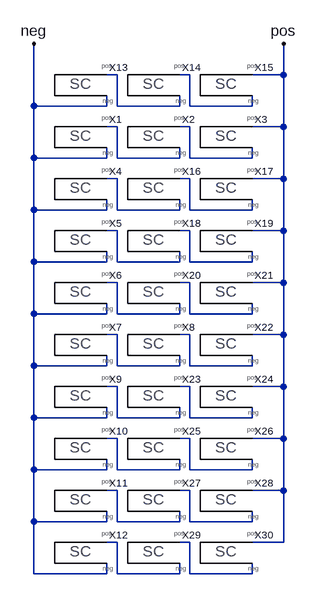
[diagram p0: schematic solarpanelsymbol.asc]
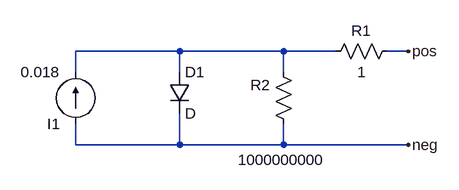
[diagram p1: sub-circuit solarcellsymbol.asc]
solarpanelsymbol.asc, the LTspice schematic file:
Version 4
SHEET 1 880 800
WIRE 176 0 160 0
WIRE 288 0 272 0
WIRE 432 0 432 -48
WIRE 432 0 384 0
WIRE 48 48 48 -48
WIRE 160 48 160 32
WIRE 160 48 48 48
WIRE 176 48 176 0
WIRE 272 48 272 32
WIRE 272 48 176 48
WIRE 288 48 288 0
WIRE 384 48 384 32
WIRE 384 48 288 48
WIRE 176 80 160 80
WIRE 288 80 272 80
WIRE 432 80 432 0
WIRE 432 80 384 80
WIRE 48 128 48 48
WIRE 160 128 160 112
WIRE 160 128 48 128
WIRE 176 128 176 80
WIRE 272 128 272 112
WIRE 272 128 176 128
WIRE 288 128 288 80
WIRE 384 128 384 112
WIRE 384 128 288 128
WIRE 176 160 160 160
WIRE 288 160 272 160
WIRE 432 160 432 80
WIRE 432 160 384 160
WIRE 48 208 48 128
WIRE 160 208 160 192
WIRE 160 208 48 208
WIRE 176 208 176 160
WIRE 272 208 272 192
WIRE 272 208 176 208
WIRE 288 208 288 160
WIRE 384 208 384 192
WIRE 384 208 288 208
WIRE 176 240 160 240
WIRE 288 240 272 240
WIRE 432 240 432 160
WIRE 432 240 384 240
WIRE 48 288 48 208
WIRE 160 288 160 272
WIRE 160 288 48 288
WIRE 176 288 176 240
WIRE 272 288 272 272
WIRE 272 288 176 288
WIRE 288 288 288 240
WIRE 384 288 384 272
WIRE 384 288 288 288
WIRE 176 320 160 320
WIRE 288 320 272 320
WIRE 432 320 432 240
WIRE 432 320 384 320
WIRE 48 368 48 288
WIRE 160 368 160 352
WIRE 160 368 48 368
WIRE 176 368 176 320
WIRE 272 368 272 352
WIRE 272 368 176 368
WIRE 288 368 288 320
WIRE 384 368 384 352
WIRE 384 368 288 368
WIRE 176 400 160 400
WIRE 288 400 272 400
WIRE 432 400 432 320
WIRE 432 400 384 400
WIRE 48 448 48 368
WIRE 160 448 160 432
WIRE 160 448 48 448
WIRE 176 448 176 400
WIRE 272 448 272 432
WIRE 272 448 176 448
WIRE 288 448 288 400
WIRE 384 448 384 432
WIRE 384 448 288 448
WIRE 176 480 160 480
WIRE 288 480 272 480
WIRE 432 480 432 400
WIRE 432 480 384 480
WIRE 48 528 48 448
WIRE 160 528 160 512
WIRE 160 528 48 528
WIRE 176 528 176 480
WIRE 272 528 272 512
WIRE 272 528 176 528
WIRE 288 528 288 480
WIRE 384 528 384 512
WIRE 384 528 288 528
WIRE 176 560 160 560
WIRE 288 560 272 560
WIRE 432 560 432 480
WIRE 432 560 384 560
WIRE 48 608 48 528
WIRE 160 608 160 592
WIRE 160 608 48 608
WIRE 176 608 176 560
WIRE 272 608 272 592
WIRE 272 608 176 608
WIRE 288 608 288 560
WIRE 384 608 384 592
WIRE 384 608 288 608
WIRE 176 640 160 640
WIRE 288 640 272 640
WIRE 432 640 432 560
WIRE 432 640 384 640
WIRE 48 688 48 608
WIRE 160 688 160 672
WIRE 160 688 48 688
WIRE 176 688 176 640
WIRE 272 688 272 672
WIRE 272 688 176 688
WIRE 288 688 288 640
WIRE 384 688 384 672
WIRE 384 688 288 688
WIRE 176 720 160 720
WIRE 288 720 272 720
WIRE 432 720 432 640
WIRE 432 720 384 720
WIRE 48 768 48 688
WIRE 160 768 160 752
WIRE 160 768 48 768
WIRE 176 768 176 720
WIRE 272 768 272 752
WIRE 272 768 176 768
WIRE 288 768 288 720
WIRE 384 768 384 752
WIRE 384 768 288 768
FLAG 432 -48 pos
FLAG 48 -48 neg
SYMBOL solarcellsymbol 112 96 R0
SYMATTR InstName X1
SYMBOL solarcellsymbol 224 96 R0
SYMATTR InstName X2
SYMBOL solarcellsymbol 336 96 R0
SYMATTR InstName X3
SYMBOL solarcellsymbol 112 176 R0
SYMATTR InstName X4
SYMBOL solarcellsymbol 112 256 R0
SYMATTR InstName X5
SYMBOL solarcellsymbol 112 336 R0
SYMATTR InstName X6
SYMBOL solarcellsymbol 112 416 R0
SYMATTR InstName X7
SYMBOL solarcellsymbol 224 416 R0
SYMATTR InstName X8
SYMBOL solarcellsymbol 112 496 R0
SYMATTR InstName X9
SYMBOL solarcellsymbol 112 576 R0
SYMATTR InstName X10
SYMBOL solarcellsymbol 112 656 R0
SYMATTR InstName X11
SYMBOL solarcellsymbol 112 736 R0
SYMATTR InstName X12
SYMBOL solarcellsymbol 112 16 R0
SYMATTR InstName X13
SYMBOL solarcellsymbol 224 16 R0
SYMATTR InstName X14
SYMBOL solarcellsymbol 336 16 R0
SYMATTR InstName X15
SYMBOL solarcellsymbol 224 176 R0
SYMATTR InstName X16
SYMBOL solarcellsymbol 336 176 R0
SYMATTR InstName X17
SYMBOL solarcellsymbol 224 256 R0
SYMATTR InstName X18
SYMBOL solarcellsymbol 336 256 R0
SYMATTR InstName X19
SYMBOL solarcellsymbol 224 336 R0
SYMATTR InstName X20
SYMBOL solarcellsymbol 336 336 R0
SYMATTR InstName X21
SYMBOL solarcellsymbol 336 416 R0
SYMATTR InstName X22
SYMBOL solarcellsymbol 224 496 R0
SYMATTR InstName X23
SYMBOL solarcellsymbol 336 496 R0
SYMATTR InstName X24
SYMBOL solarcellsymbol 224 576 R0
SYMATTR InstName X25
SYMBOL solarcellsymbol 336 576 R0
SYMATTR InstName X26
SYMBOL solarcellsymbol 224 656 R0
SYMATTR InstName X27
SYMBOL solarcellsymbol 336 656 R0
SYMATTR InstName X28
SYMBOL solarcellsymbol 224 736 R0
SYMATTR InstName X29
SYMBOL solarcellsymbol 336 736 R0
SYMATTR InstName X30

solarcellsymbol.asc, the sub-circuit schematic file:
Version 4
SHEET 1 880 680
WIRE 32 80 -128 80
WIRE 192 80 32 80
WIRE 272 80 192 80
WIRE 384 80 352 80
WIRE -128 112 -128 80
WIRE 32 112 32 80
WIRE 192 112 192 80
WIRE -128 224 -128 192
WIRE 32 224 32 176
WIRE 32 224 -128 224
WIRE 192 224 192 192
WIRE 192 224 32 224
WIRE 384 224 192 224
FLAG 384 80 pos
FLAG 384 224 neg
SYMBOL current -128 192 R180
WINDOW 123 0 0 Left 0
WINDOW 39 0 0 Left 0
SYMATTR InstName I1
SYMATTR Value 0.018
SYMBOL diode 16 112 R0
SYMATTR InstName D1
SYMBOL res 368 64 R90
WINDOW 0 0 56 VBottom 2
WINDOW 3 32 56 VTop 2
SYMATTR InstName R1
SYMATTR Value 1
SYMBOL res 208 208 R180
WINDOW 0 36 76 Left 2
WINDOW 3 -49 -39 Left 2
SYMATTR InstName R2
SYMATTR Value 1000000000

The netlist it stands for:
* solarpanelsymbol.asc
XX1 N003 neg solarcellsymbol
XX2 N004 N003 solarcellsymbol
XX3 pos N004 solarcellsymbol
XX4 N005 neg solarcellsymbol
XX5 N007 neg solarcellsymbol
XX6 N009 neg solarcellsymbol
XX7 N011 neg solarcellsymbol
XX8 N012 N011 solarcellsymbol
XX9 N013 neg solarcellsymbol
XX10 N015 neg solarcellsymbol
XX11 N017 neg solarcellsymbol
XX12 N019 neg solarcellsymbol
XX13 N001 neg solarcellsymbol
XX14 N002 N001 solarcellsymbol
XX15 pos N002 solarcellsymbol
XX16 N006 N005 solarcellsymbol
XX17 pos N006 solarcellsymbol
XX18 N008 N007 solarcellsymbol
XX19 pos N008 solarcellsymbol
XX20 N010 N009 solarcellsymbol
XX21 pos N010 solarcellsymbol
XX22 pos N012 solarcellsymbol
XX23 N014 N013 solarcellsymbol
XX24 pos N014 solarcellsymbol
XX25 N016 N015 solarcellsymbol
XX26 pos N016 solarcellsymbol
XX27 N018 N017 solarcellsymbol
XX28 pos N018 solarcellsymbol
XX29 N020 N019 solarcellsymbol
XX30 pos N020 solarcellsymbol

* block symbol definitions
.subckt solarcellsymbol pos neg
I1 neg N001 0.018
D1 N001 neg D
R1 pos N001 1
R2 neg N001 1000000000
.ends solarcellsymbol

.model D D
.lib standard.dio
.backanno
.end